# EAGLE design SAMD_Test_Board (EAGLE 9.6.2)

## Sheet 1 of 3: ARM SAMD21
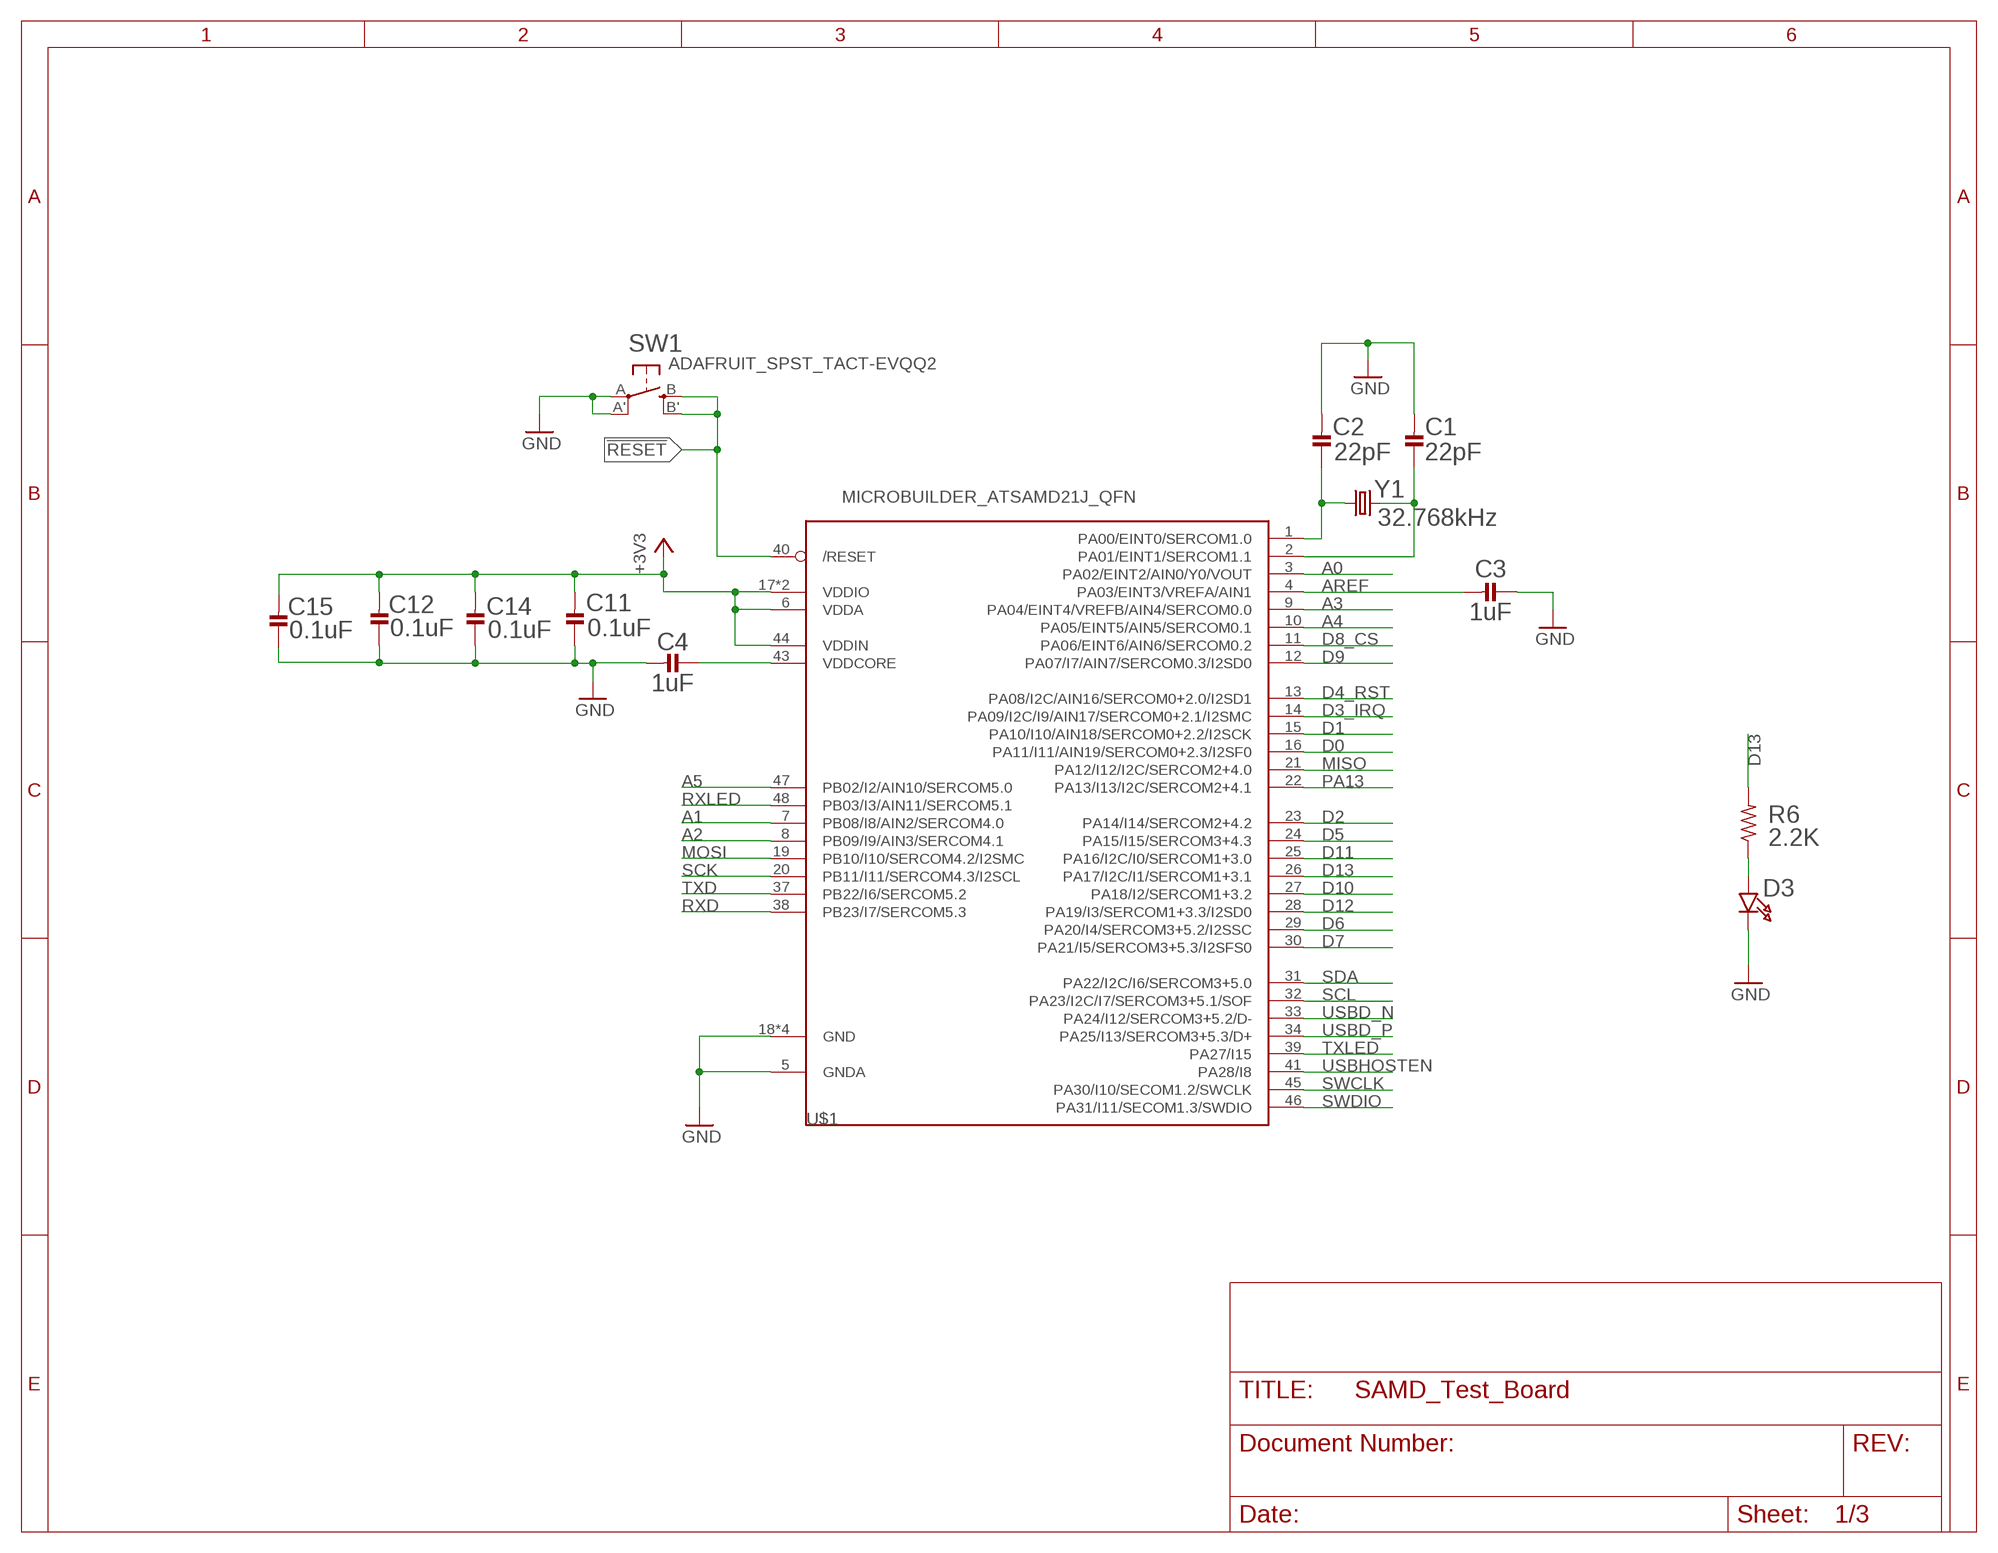
[diagram p0: schematic, sheet 1]

### Parts
C1  22pF  MICROBUILDER_CAP_CERAMIC_0805  [MICROBUILDER__0805]
C2  22pF  MICROBUILDER_CAP_CERAMIC_0805  [MICROBUILDER__0805]
C3  1uF  MICROBUILDER_CAP_CERAMIC_0805  [MICROBUILDER__0805]
C4  1uF  MICROBUILDER_CAP_CERAMIC_0805  [MICROBUILDER__0805]
C11  0.1uF  MICROBUILDER_CAP_CERAMIC_0805  [MICROBUILDER__0805]
C12  0.1uF  MICROBUILDER_CAP_CERAMIC_0805  [MICROBUILDER__0805]
C14  0.1uF  MICROBUILDER_CAP_CERAMIC_0805  [MICROBUILDER__0805]
C15  0.1uF  MICROBUILDER_CAP_CERAMIC_0805  [MICROBUILDER__0805]
D3  MICROBUILDER_LED0603  [MICROBUILDER_CHIPLED_0603]
R6  2.2K  R-US_R0805  [R0805]
SW1  ADAFRUIT_SPST_TACT-EVQQ2  [ADAFRUIT_EVQ-Q2]
U$1  MICROBUILDER_ATSAMD21J_QFN  [MICROBUILDER_TQFN48_7MM]
Y1  32.768kHz  CRYSTAL-32.768KHZSMD-3.2X1.5  [CRYSTAL-SMD-3.2X1.5MM]

### Nets
!RESET: SW1.B'(S1) SW1.B(S) U$1.40(/RESET)
+3V3 [Power]: C11.2 C12.2 C14.2 C15.2 U$1.6(VDDA) U$1.17(VDDIO) U$1.36(VDDIO) U$1.44(VDDIN) ; also sheet 2,3
A0: U$1.3(PA02/EINT2/AIN0/Y0/VOUT)
A1: U$1.7(PB08/I8/AIN2/SERCOM4.0)
A2: U$1.8(PB09/I9/AIN3/SERCOM4.1)
A3: U$1.9(PA04/EINT4/VREFB/AIN4/SERCOM0.0)
A4: U$1.10(PA05/EINT5/AIN5/SERCOM0.1)
A5: U$1.47(PB02/I2/AIN10/SERCOM5.0)
AREF: C3.2 U$1.4(PA03/EINT3/VREFA/AIN1)
D0: U$1.16(PA11/I11/AIN19/SERCOM0+2.3/I2SF0) ; also sheet 3
D1: U$1.15(PA10/I10/AIN18/SERCOM0+2.2/I2SCK) ; also sheet 3
D2: U$1.23(PA14/I14/SERCOM2+4.2)
D3_IRQ: U$1.14(PA09/I2C/I9/AIN17/SERCOM0+2.1/I2SMC) ; also sheet 2,3
D4_RST: U$1.13(PA08/I2C/AIN16/SERCOM0+2.0/I2SD1) ; also sheet 2,3
D5: U$1.24(PA15/I15/SERCOM3+4.3) ; also sheet 3
D6: U$1.29(PA20/I4/SERCOM3+5.2/I2SSC) ; also sheet 3
D7: U$1.30(PA21/I5/SERCOM3+5.3/I2SFS0)
D8_CS: U$1.11(PA06/EINT6/AIN6/SERCOM0.2) ; also sheet 2,3
D9: U$1.12(PA07/I7/AIN7/SERCOM0.3/I2SD0) ; also sheet 2,3
D10: U$1.27(PA18/I2/SERCOM1+3.2) ; also sheet 3
D11: U$1.25(PA16/I2C/I0/SERCOM1+3.0) ; also sheet 3
D12: U$1.28(PA19/I3/SERCOM1+3.3/I2SD0) ; also sheet 3
D13: R6.2 U$1.26(PA17/I2C/I1/SERCOM1+3.1) ; also sheet 3
GND [Power]: C1.2 C2.2 C3.1 C4.2 C11.1 C12.1 C14.1 C15.1 D3.C SW1.A'(P1) SW1.A(P) U$1.5(GNDA) U$1.18(GND) U$1.35(GND) U$1.42(GND) U$1.THERMAL(GND) ; also sheet 2,3
MISO: U$1.21(PA12/I12/I2C/SERCOM2+4.0) ; also sheet 2,3
MOSI: U$1.19(PB10/I10/SERCOM4.2/I2SMC) ; also sheet 2,3
N$1: C2.1 U$1.1(PA00/EINT0/SERCOM1.0) Y1.P$1
N$2: C1.1 U$1.2(PA01/EINT1/SERCOM1.1) Y1.P$2
N$4: C4.1 U$1.43(VDDCORE)
N$12: D3.A R6.1
PA13: U$1.22(PA13/I13/I2C/SERCOM2+4.1) ; also sheet 3
RXD: U$1.38(PB23/I7/SERCOM5.3) ; also sheet 3
RXLED: U$1.48(PB03/I3/AIN11/SERCOM5.1) ; also sheet 3
SCK: U$1.20(PB11/I11/SERCOM4.3/I2SCL) ; also sheet 2,3
SCL: U$1.32(PA23/I2C/I7/SERCOM3+5.1/SOF) ; also sheet 2,3
SDA: U$1.31(PA22/I2C/I6/SERCOM3+5.0) ; also sheet 2,3
SWCLK: U$1.45(PA30/I10/SECOM1.2/SWCLK) ; also sheet 3
SWDIO: U$1.46(PA31/I11/SECOM1.3/SWDIO) ; also sheet 3
TXD: U$1.37(PB22/I6/SERCOM5.2) ; also sheet 3
TXLED: U$1.39(PA27/I15) ; also sheet 3
USBD_N [USB_Diff_pair]: U$1.33(PA24/I12/SERCOM3+5.2/D-) ; also sheet 2
USBD_P [USB_Diff_pair]: U$1.34(PA25/I13/SERCOM3+5.3/D+) ; also sheet 2
USBHOSTEN: U$1.41(PA28/I8)

## Sheet 2 of 3: On-Board Modules
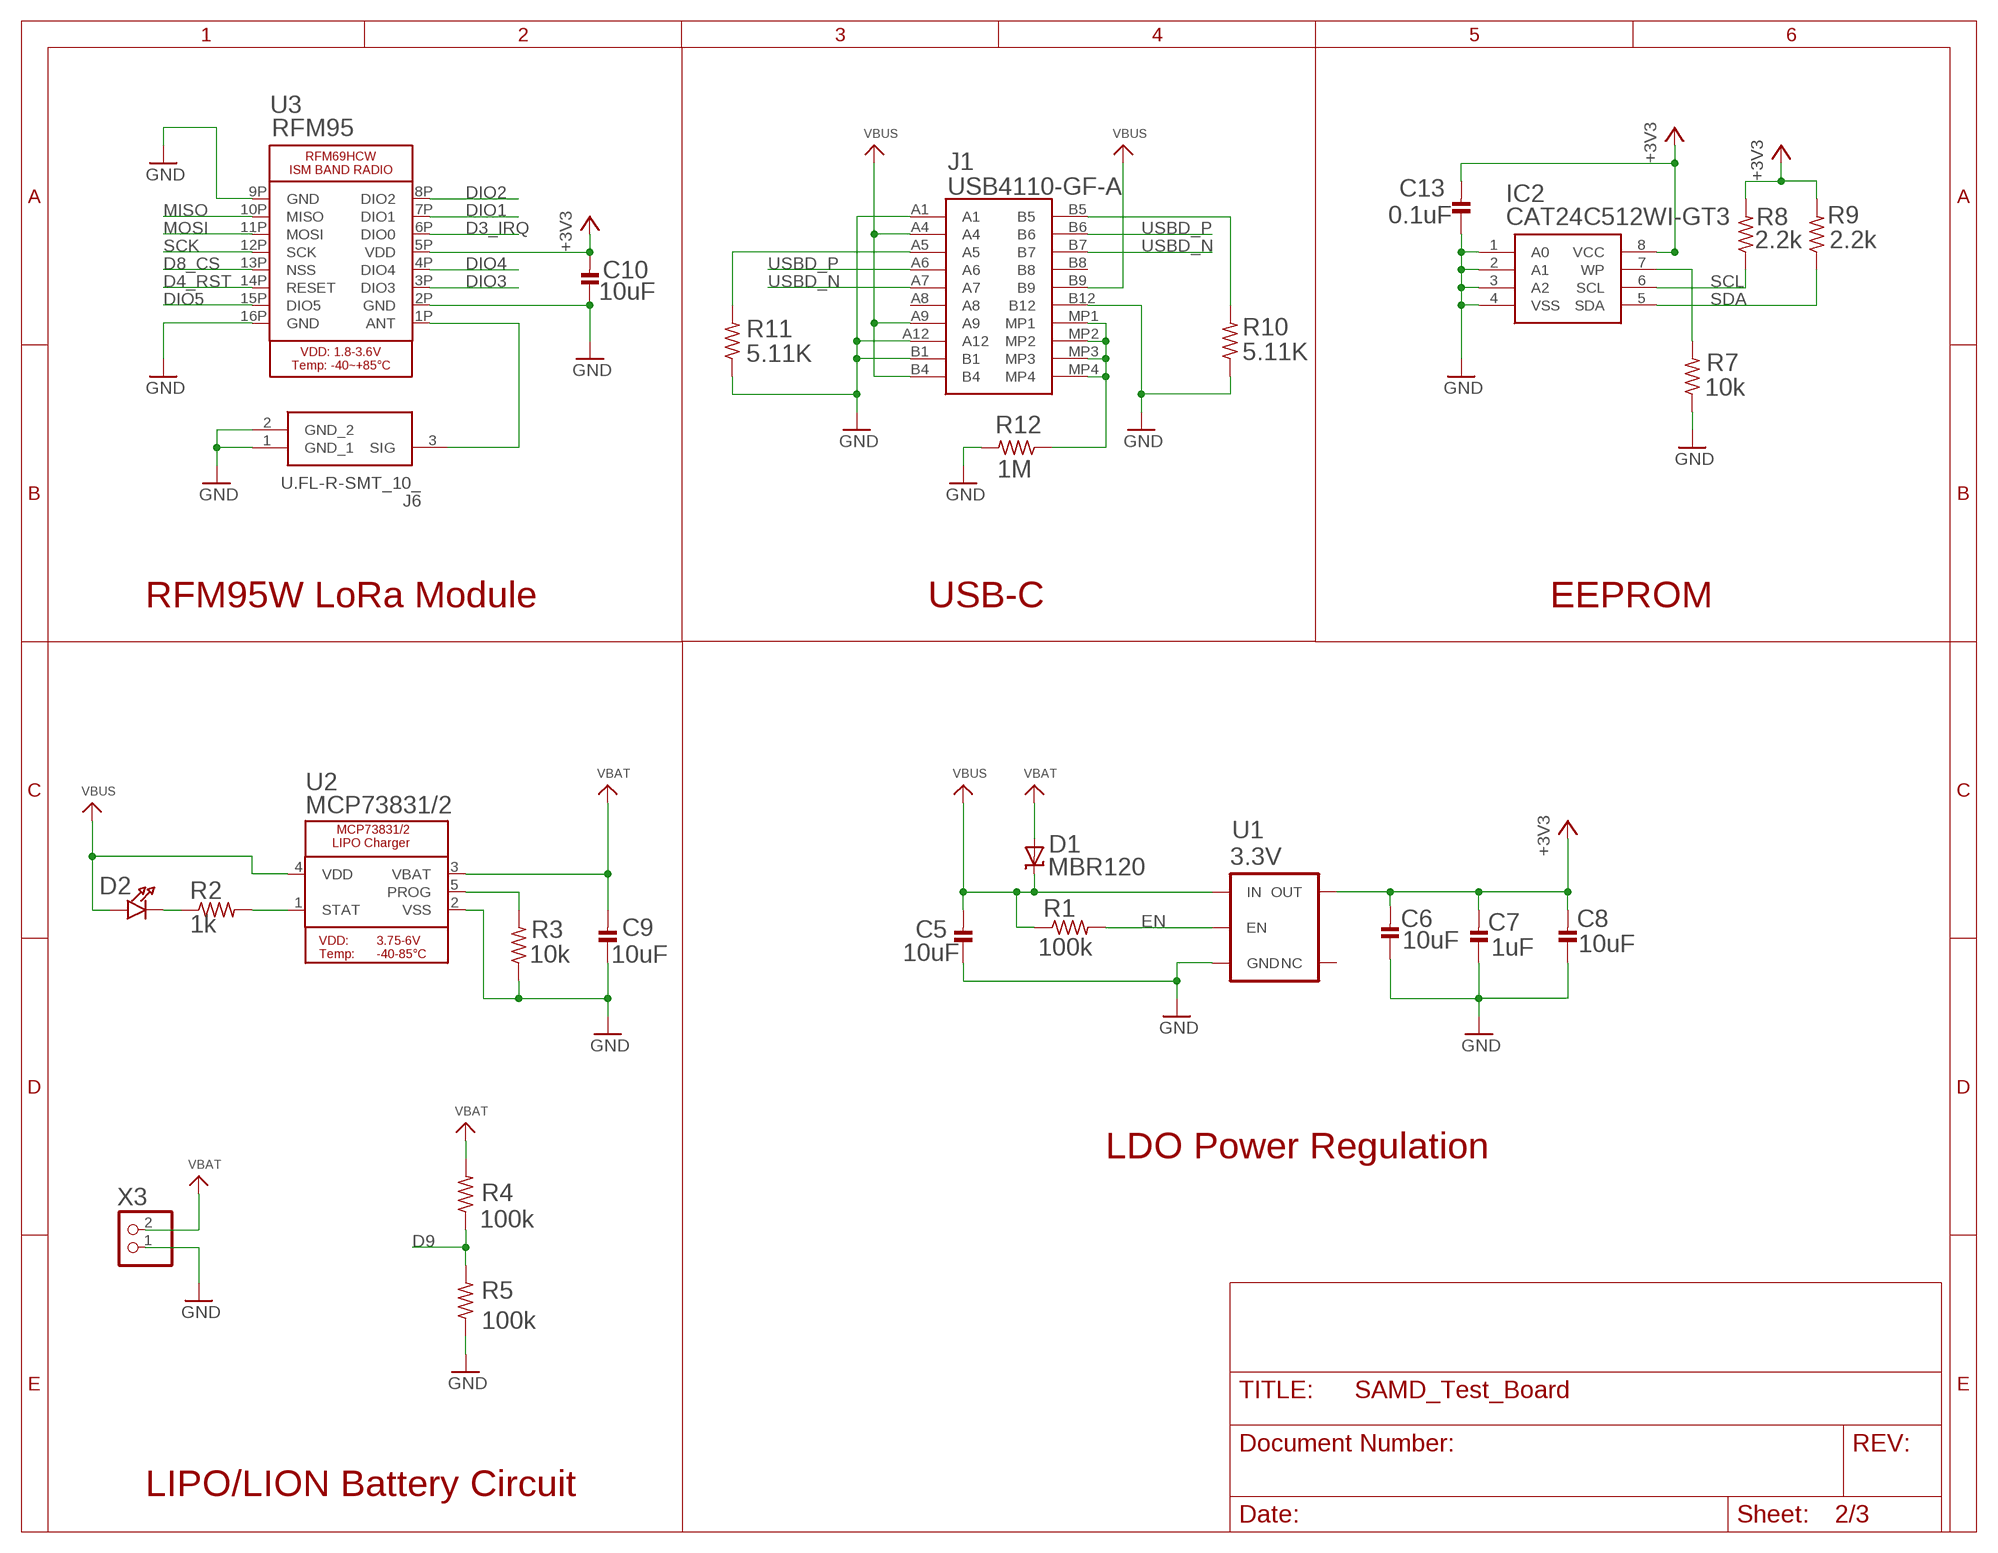
[diagram p1: schematic, sheet 2]

### Parts
C5  10uF  MICROBUILDER_CAP_CERAMIC_0805  [MICROBUILDER__0805]
C6  10uF  MICROBUILDER_CAP_CERAMIC_0805  [MICROBUILDER__0805]
C7  1uF  MICROBUILDER_CAP_CERAMIC_0805  [MICROBUILDER__0805]
C8  10uF  MICROBUILDER_CAP_CERAMIC_0805  [MICROBUILDER__0805]
C9  10uF  MICROBUILDER_CAP_CERAMIC_0805  [MICROBUILDER__0805]
C10  10uF  MICROBUILDER_CAP_CERAMIC_0805  [MICROBUILDER__0805]
C13  0.1uF  MICROBUILDER_CAP_CERAMIC_0805  [MICROBUILDER__0805]
D1  MBR120  MICROBUILDER_DIODE-SCHOTTKYSOD-123  [MICROBUILDER_SOD-123]
D2  MICROBUILDER_LED0603  [MICROBUILDER_CHIPLED_0603]
IC2  CAT24C512WI-GT3  [SOIC127P600X175-8N]
J1  USB4110-GF-A  [USB4110GFA]
J6  U.FL-R-SMT_10_  [UFLRSMT10]
R1  100k  R-US_R0805  [R0805]
R2  1k  R-US_R0805  [R0805]
R3  10k  R-US_R0805  [R0805]
R4  100k  R-US_R0805  [R0805]
R5  100k  R-US_R0805  [R0805]
R7  10k  R-US_R0805  [R0805]
R8  2.2k  R-US_R0805  [R0805]
R9  2.2k  R-US_R0805  [R0805]
R10  5.11K  R-US_R0805  [R0805]
R11  5.11K  R-US_R0805  [R0805]
R12  1M  R-US_R0805  [R0805]
U1  3.3V  V_REG_AP2112K-3.3V  [SOT23-5]
U2  MCP73831/2  MICROBUILDER_MCP73831/2  [MICROBUILDER_SOT23-5]
U3  RFM95  MICROBUILDER_RFM69HCW_SMT  [MICROBUILDER_RFMHCW_SMT]
X3  MICROBUILDER_CON_JST_PH_2PIN  [MICROBUILDER_JSTPH2]

### Nets
+3V3 [Power]: C6.2 C7.2 C8.2 C10.2 C13.2 IC2.8(VCC) R8.2 R9.2 U1.5(OUT) U3.5P(VDD) ; also sheet 1,3
D3_IRQ: U3.6P(DIO0) ; also sheet 1,3
D4_RST: U3.14P(RESET) ; also sheet 1,3
D8_CS: U3.13P(NSS) ; also sheet 1,3
D9: R4.1 R5.2 ; also sheet 1,3
DIO1: U3.7P(DIO1) ; also sheet 3
DIO2: U3.8P(DIO2) ; also sheet 3
DIO3: U3.3P(DIO3) ; also sheet 3
DIO4: U3.4P(DIO4) ; also sheet 3
DIO5: U3.15P(DIO5) ; also sheet 3
EN: R1.2 U1.3(EN) ; also sheet 3
GND [Power]: C5.1 C6.1 C7.1 C8.1 C9.1 C10.1 C13.1 IC2.1(A0) IC2.2(A1) IC2.3(A2) IC2.4(VSS) J1.A1 J1.A12 J1.B1 J1.B12 J6.1(GND_1) J6.2(GND_2) R3.1 R5.1 R7.1 R10.1 R11.1 R12.2 U1.2(GND) U2.2(VSS) U3.2P(GND) U3.9P(GND) U3.16P(GND) X3.1 ; also sheet 1,3
MISO: U3.10P(MISO) ; also sheet 1,3
MOSI: U3.11P(MOSI) ; also sheet 1,3
N$3: IC2.7(WP) R7.2
N$5: J1.A5 R11.2
N$6: D2.C R2.1
N$7: R2.2 U2.1(STAT)
N$8: R3.2 U2.5(PROG)
N$9: J1.B5 R10.2
N$10: J1.MP1 J1.MP2 J1.MP3 J1.MP4 R12.1
N$13: J6.3(SIG) U3.1P(ANT)
SCK: U3.12P(SCK) ; also sheet 1,3
SCL: IC2.6(SCL) R8.1 ; also sheet 1,3
SDA: IC2.5(SDA) R9.1 ; also sheet 1,3
USBD_N [USB_Diff_pair]: J1.A7 J1.B7 ; also sheet 1
USBD_P [USB_Diff_pair]: J1.A6 J1.B6 ; also sheet 1
VBAT [Power]: C9.2 D1.A R4.2 U2.3(VBAT) X3.2 ; also sheet 3
VBUS [Power]: C5.2 D1.C D2.A J1.A4 J1.A9 J1.B4 J1.B9 R1.1 U1.1(IN) U2.4(VDD) ; also sheet 3
Unconnected: J1.A8 J1.B8 U1.4(NC)

### Notes on the sheet
- RFM95W LoRa Module | USB-C | EEPROM
- LDO Power Regulation
- LIPO/LION Battery Circuit

## Sheet 3 of 3: Peripherals
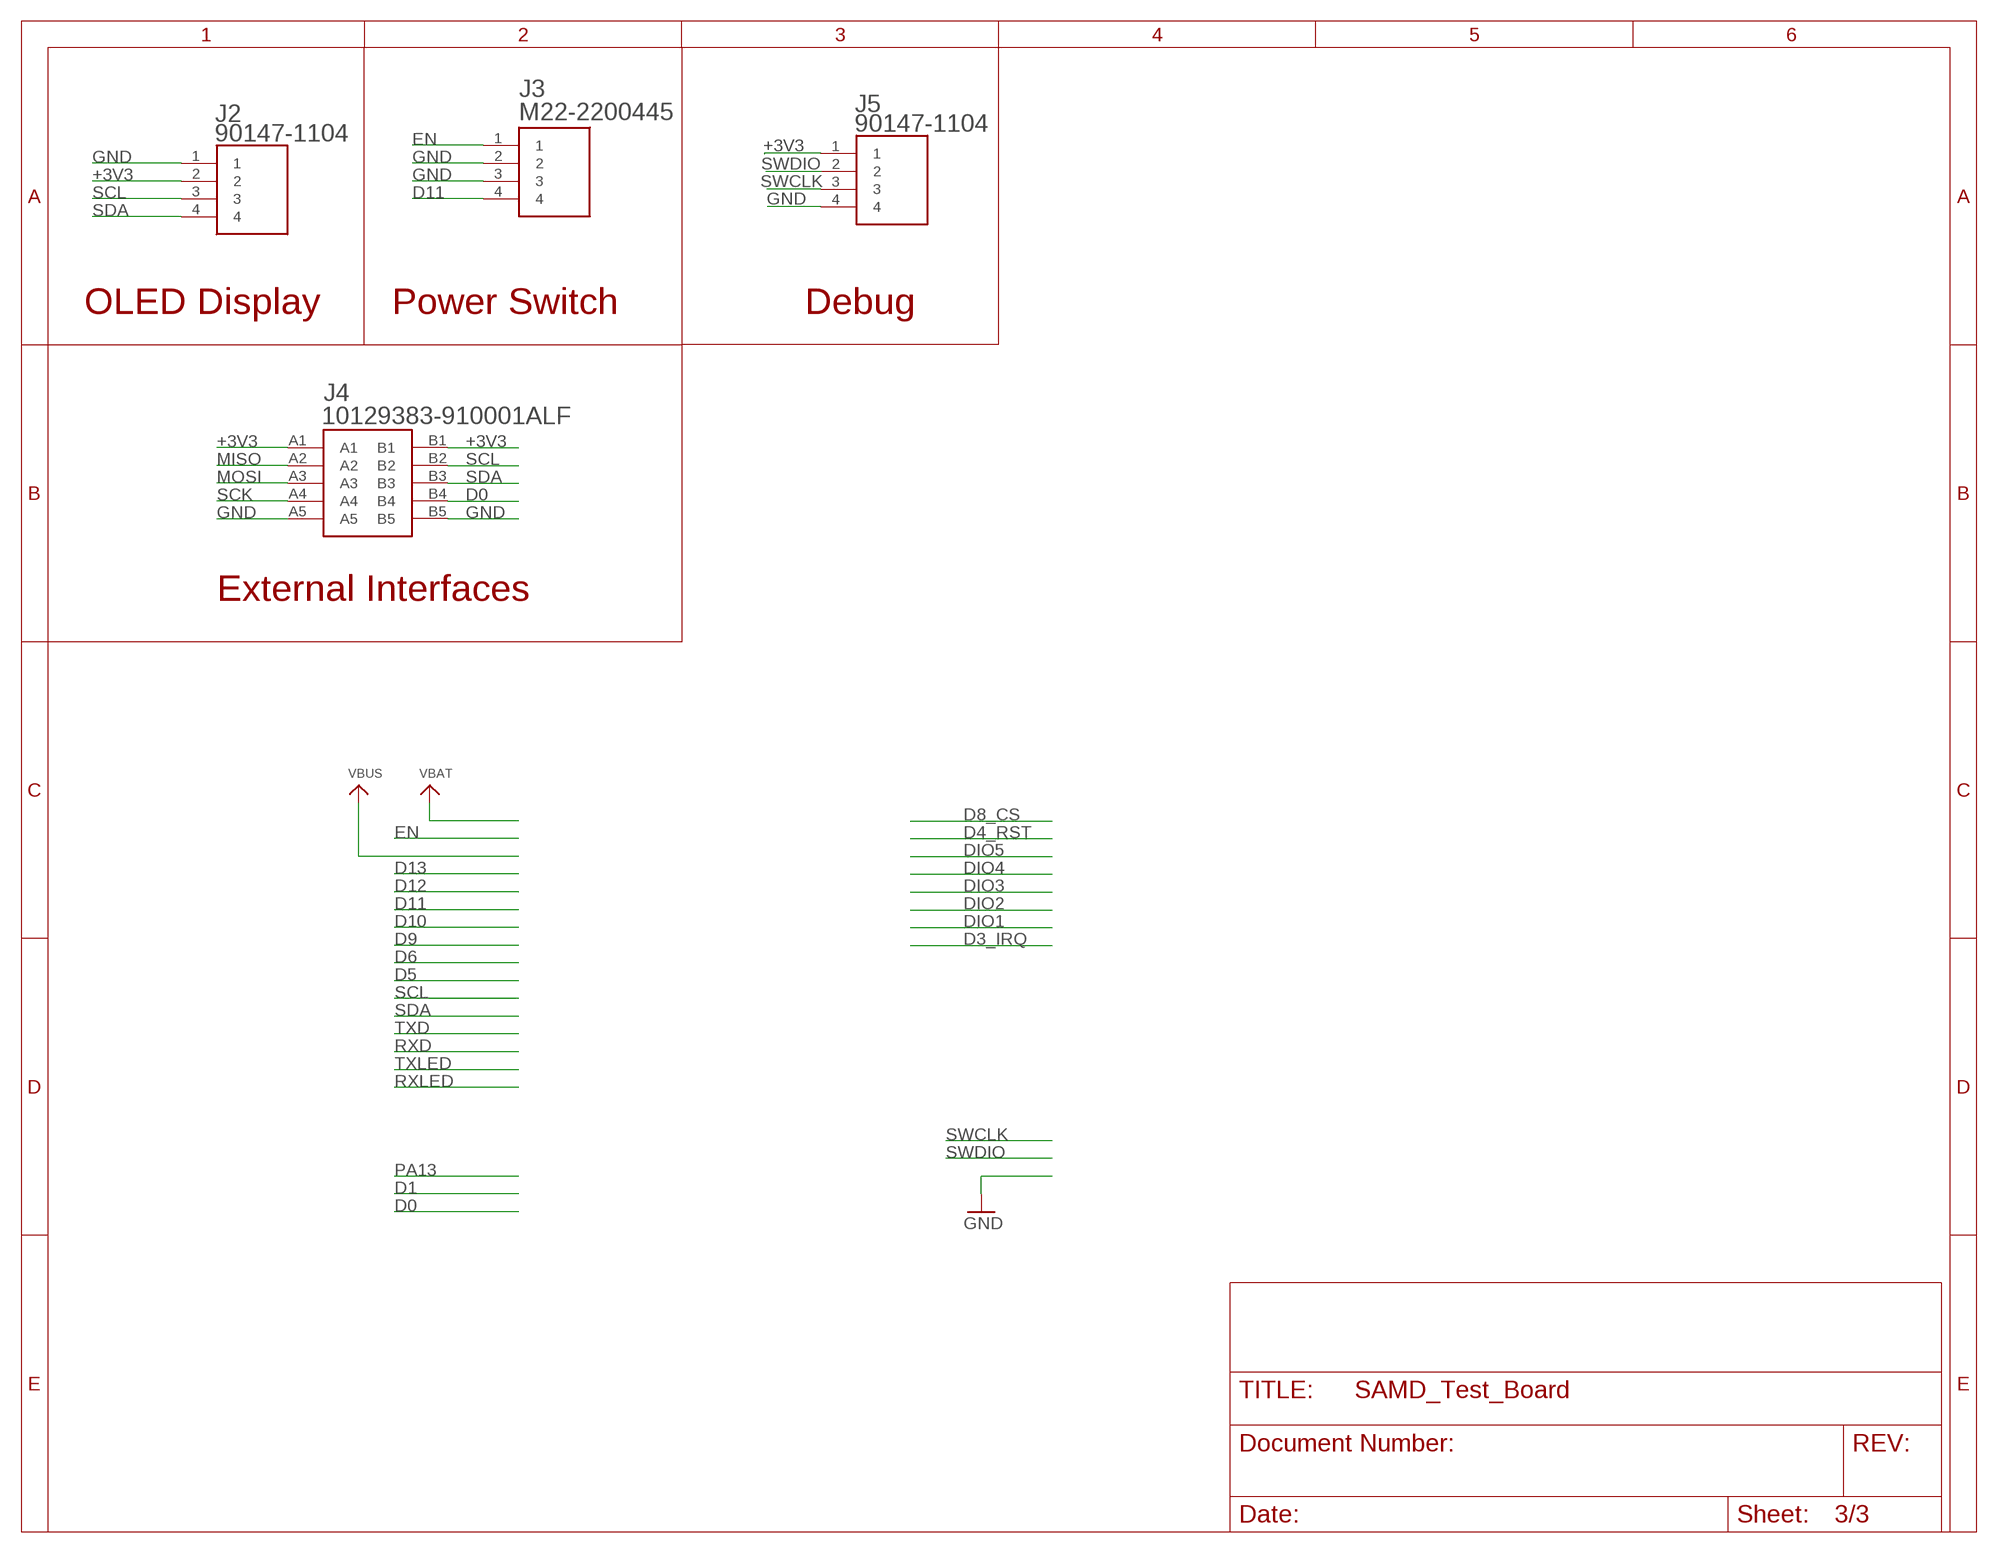
[diagram p2: schematic, sheet 3]

### Parts
J2  90147-1104  [RHDR4W70P0X254_1X4_1016X244X87]
J3  M22-2200445  [SHDR4W50P0X200_1X4_1000X470X63]
J4  10129383-910001ALF  [10129383910001ALF]
J5  90147-1104  [RHDR4W70P0X254_1X4_1016X244X87]

### Nets
+3V3 [Power]: J2.2 J4.A1 J4.B1 J5.1 ; also sheet 1,2
D0: J4.B4 ; also sheet 1
D11: J3.4 ; also sheet 1
EN: J3.1 ; also sheet 2
GND [Power]: J2.1 J3.2 J3.3 J4.A5 J4.B5 J5.4 ; also sheet 1,2
MISO: J4.A2 ; also sheet 1,2
MOSI: J4.A3 ; also sheet 1,2
SCK: J4.A4 ; also sheet 1,2
SCL: J2.3 J4.B2 ; also sheet 1,2
SDA: J2.4 J4.B3 ; also sheet 1,2
SWCLK: J5.3 ; also sheet 1
SWDIO: J5.2 ; also sheet 1

### Notes on the sheet
- OLED Display | Power Switch | Debug
- External Interfaces

## Library data of the parts
C1-C15 = Adafruit Feather M0 RFMxx:MICROBUILDER_CAP_CERAMIC: Ceramic Capacitors For new designs, use the packages preceded by an '_' character since they are more reliable: The following footprints should be used on most boards: _0402 - Standard footprint for regular board layouts _0603 - Standard footprint for regular board layouts _0805 - Standard footprint for regular board layouts _1206 - Standard footprint for regular board layouts For extremely tight-pitch boards where space is at a premium, the following 'micro-pitch' footprints can be used (smaller pads, no silkscreen outline, etc.): _0402MP - Micro-pitch footprint for very dense/compact boards _0603MP - Micro-pitch footprint for very dense/compact boards _0805MP - Micro-pitch footprint for very dense/compact boards _1206MP - Micro-pitch footprint for very dense/compact boards
D1 = Adafruit Feather M0 RFMxx:MICROBUILDER_DIODE-SCHOTTKY
D2 D3 = Adafruit Feather M0 RFMxx:MICROBUILDER_LED: LED 0603 - 0603 Surface Mount Package 2mA: Green LED - Low Power (3.9mcd, 2ma, 1.7Vf) - Digikey: 475-2709-2-ND Orange LED - Low Power (9.8mcd, 2ma, 1.8Vf) - Digikey: 475-1194-2-ND Red LED - Low Power (5mcd, 2ma, 1.8Vf) - Digikey: 475-1195-2-ND Yellow LED - Low Power (7mcd, 2ma, 1.8Vf) - Digikey: 475-1196-2-ND 5mA: Blue LED - Low Power (17mcd, 5ma, 2.9Vf) - Digikey: LNJ937W8CRACT-ND 0805 - 0805 Surface Mount Package 2mA: Red LED (8.8mcd, 2mA, 1.8Vf, Clear) - Low Power [Digikey: 475-2510-1-ND] Green LED (5mcd, 2mA, 1.8Vf, Clear) - Low Power [Digikey: 475-2730-1-ND] Yellow LED (11.3mcd, 2mA, 1.8Vf, Clear) - Low Power [Digikey: 475-2555-1-ND] 20mA: Red LED (104mcd, 20mA, Diffused) - LS R976 [Digikey: 475-1278-6-ND] Red LED (12mcd, 20mA, 2.0Vf, Clear) - APT2012EC [Digikey: 754-1128-1-ND] Green LED (15mcd, 20mA, 2.2Vf, Clear) - APT2012GC [Digikey: 754-1131-1-ND] Orange LED (160mcd, 20mA, 2.1Vf, Clear) - APT2012SECK [Digikey: 754-1130-1-ND] 1206 - 1206 Surface Mount Package Green LED (26mcd, 20mA, Diffused) - LG N971 [Digikey: 475-1407-6-ND] Red LED (15mcd, 20mA, Diffused) - LH N974 [Digikey: 475-1416-6-ND] Cree - Cree High-Power Surface Mount LEDs XPEBWT-L1-0000-00D50 - White 111lm 350mA 2.9Vf 6200K 110° XTEAWT-00-0000-00000LEE3 - White 114lm 350mA 2.85Vf 5000K 115° Everlight - Everlight 45-21 Series Surface Mount LEDs 45-21/QK2C-B2832AC2CB2/2T - Warm White 2000mcd 20mA 3.25Vf 3050K 120° 45-21/LK2C-B38452C4CB2/2T - Nuetral White 2000mcd 20mA 3.25Vf 4150K 120° 45-21/LK2C-B50634C6CB2/2T - Cold White 2200mcd 20mA 3.25Vf 5650K 120° PLCC2 Reverse Mount LS T77K-J1L2-1-0-2-R18-Z - Red 11.25mcd 2mA 1.8Vf 630nm 120° LO T77K-L1M2-24-Z - Orange 19.6mcd 2mA 1.8Vf 606nm 120° LY T77K-K2M1-26-Z - Yellow 15.7mcd 2mA 1.8Vf 587nm 120°
IC2 = SamacSys_Parts:CAT24C512WI-GT3: EEPROM,512kbit,64Kx8,1MHz I2C,SOIC8 ON Semiconductor CAT24C512WI-GT3 EEPROM Memory, 512kb, 400ns, 1.8 5.5 V 8-Pin SOIC Source: Datasheet <http://www.onsemi.com/pub/Collateral/CAT24C512-D.PDF>; DESCRIPTION: EEPROM,512kbit,64Kx8,1MHz I2C,SOIC8 ON Semiconductor CAT24C512WI-GT3 EEPROM Memory, 512kb, 400ns, 1.8 5.5 V 8-Pin SOIC; HEIGHT: 1.75mm; MANUFACTURER_NAME: ON Semiconductor; MANUFACTURER_PART_NUMBER: CAT24C512WI-GT3; MOUSER_PART_NUMBER: 863-CAT24C512WI-GT3; MOUSER_PRICE-STOCK: https://www.mouser.co.uk/ProductDetail/ON-Semiconductor/CAT24C512WI-GT3?qs=NJQfjRgVp6ROyXrGKjEjgQ%3D%3D
J1 = SamacSys_Parts:USB4110-GF-A: CONN USB 2.0 TYPE-C R/A SMT Source: Datasheet <https://gct.co/files/drawings/usb4110.pdf>; DESCRIPTION: CONN USB 2.0 TYPE-C R/A SMT; HEIGHT: 3.26mm; MANUFACTURER_NAME: GCT (GLOBAL CONNECTOR TECHNOLOGY); MANUFACTURER_PART_NUMBER: USB4110-GF-A; MOUSER_PART_NUMBER: 640-USB4110-GF-A; MOUSER_PRICE-STOCK: https://www.mouser.co.uk/ProductDetail/GCT/USB4110-GF-A?qs=KUoIvG%2F9IlYiZvIXQjyJeA%3D%3D
J2 J5 = SamacSys_Parts:90147-1104: Headers & Wire Housings 2.54MM 4P PCB CONN SR VERTICAL Source: Datasheet; DESCRIPTION: Headers & Wire Housings 2.54MM 4P PCB CONN SR VERTICAL; HEIGHT: 8.7mm; MANUFACTURER_NAME: Molex; MANUFACTURER_PART_NUMBER: 90147-1104; MOUSER_PART_NUMBER: 538-90147-1104; MOUSER_PRICE-STOCK: https://www.mouser.co.uk/ProductDetail/Molex/90147-1104?qs=QESXi79X%252BKpRACDRmfEx7Q%3D%3D
J3 = SamacSys_Parts:M22-2200445: 4 SIL VERT SHROUDED PIN HDR ROHS COMPLIANT: YES Source: Datasheet; DESCRIPTION: 4 SIL VERT SHROUDED PIN HDR ROHS COMPLIANT: YES; HEIGHT: 6.35mm; MANUFACTURER_NAME: Harwin; MANUFACTURER_PART_NUMBER: M22-2200445; MOUSER_PART_NUMBER: 855-M22-2200445; MOUSER_PRICE-STOCK: https://www.mouser.co.uk/ProductDetail/Harwin/M22-2200445/?qs=p%252BybrH12zCH0J5aaSlth2Q%3D%3D
J4 = SamacSys_Parts:10129383-910001ALF: EconoStik, Board to Board connector, Unshrouded Vertical Header, Surface Mount, Double Row, Positions, 2.54 mm (0.100in) Pitch. Source: Datasheet <https://cdn.amphenol-icc.com/media/wysiwyg/files/drawing/10129383.pdf>; DESCRIPTION: EconoStik, Board to Board connector, Unshrouded Vertical Header, Surface Mount, Double Row, Positions, 2.54 mm (0.100in) Pitch.; HEIGHT: 9.85mm; MANUFACTURER_NAME: Amphenol; MANUFACTURER_PART_NUMBER: 10129383-910001ALF; MOUSER_PART_NUMBER: 649-1012938391001ALF; MOUSER_PRICE-STOCK: https://www.mouser.co.uk/ProductDetail/Amphenol-FCI/10129383-910001ALF?qs=0lQeLiL1qyY3dF%252BDHWxqLA%3D%3D
J6 = SamacSys_Parts:U.FL-R-SMT_10_: RF Connectors / Coaxial Connectors U.FL RECEPTACLE SMT GLD M CONT REEL Source: Datasheet <https://media.digikey.com/pdf/Data Sheets/Hirose PDFs/UFL Series.pdf>; DESCRIPTION: RF Connectors / Coaxial Connectors U.FL RECEPTACLE SMT GLD M CONT REEL; HEIGHT: 1.25mm; MANUFACTURER_NAME: Hirose; MANUFACTURER_PART_NUMBER: U.FL-R-SMT(10); MOUSER_PART_NUMBER: 798-U.FL-R-SMT10; MOUSER_PRICE-STOCK: https://www.mouser.co.uk/ProductDetail/Hirose-Connector/UFL-R-SMT10?qs=Ux3WWAnHpjBT1CWD8UMEMQ%3D%3D
R1-R7 R9-R12 = Adafruit Feather M0 RFMxx:R-US_: RESISTOR, American symbol
R8 = Adafruit Feather M0 RFMxx:R-US_: RESISTOR, American symbol; MOUSER: CR0805-JW-202ELF
SW1 = Adafruit Feather M0 RFMxx:ADAFRUIT_SPST_TACT: SMT 6mm switch, EVQQ2 series http://www.ladyada.net/library/eagle
U1 = SamacSys_Parts:V_REG_AP2112: AP2112 - 600mA CMOS LDO Regulator w/ Enable The AP2112 is CMOS process low dropout linear regulator with enable function, the regulator delivers a guaranteed 600mA (min.) continuous load current. Features Output Voltage Accuracy: ±1.5% Output Current: 600mA (Min.) Foldback Short Current Protection: 50mA Enable Function to Turn ON/OFF VOUT Low Dropout Voltage (3.3V): 250mV (Typ.) @IOUT=600mA Excellent Load Regulation: 0.2%/A (Typ.) Excellent Line Regulation: 0.02%/V (Typ.) Low Quiescent Current: 55μA (Typ.) Low Standby Current: 0.01μA (Typ.) Low Output Noise: 50μVRMS PSRR: 100Hz -65dB, 1kHz -65dB OTSD Protection Stable with 1.0μF Flexible Cap: Ceramic, Tantalum and Aluminum Electrolytic Operation Temperature Range: -40°C to 85°C ESD: MM 400V, HBM 4000V; PROD_ID: VREG-12457
U2 = Adafruit Feather M0 RFMxx:MICROBUILDER_MCP73831/2: MCP73831/2 LIPO Charger VDD: 3.75 - 6V Temp -40 - 85°C Programmable Charge Rate: 15-500mA NOTE: STAT is a tri-state logic output on the MCP73831 and an open-drain output on the MCP73832. SOT23-5 with 4.2V output and tri-state logic on STAT = MCP73831T-2ACI/OT
U3 = Adafruit Feather M0 RFMxx:MICROBUILDER_RFM69HCW: RFM69HCW - ISM Band RF Transceiver
U$1 = Adafruit Feather M0 RFMxx:MICROBUILDER_ATSAMD21J
X3 = Adafruit Feather M0 RFMxx:MICROBUILDER_CON_JST_PH_2PIN: JST 2-Pin Right-Angle Connector PH-Series - 4UConnector: 17311 SH-Series - 4UConnector: 07278
Y1 = SparkFun-Clocks:CRYSTAL-32.768KHZ: 32.768kHz Crystal Frequency: 32.768kHz Frequency Stability: ±20ppm Load Capacitance: 12.5pF (PTH-2X6 & SMD-3.2X1.5), 6pF (SMD-2X6) SparkFun Products: SparkFun BigTime Watch Kit <https://www.sparkfun.com/products/11734> SparkFun nRF52832 Breakout <https://www.sparkfun.com/products/13990> SparkFun Real Time Clock Module <https://www.sparkfun.com/products/12708>; PROD_ID: XTAL-13062

## Net classes
0 default: width 0.152 mm
1 USB_Diff_pair: width 0.152 mm
2 Power: width 0.254 mm

## Board
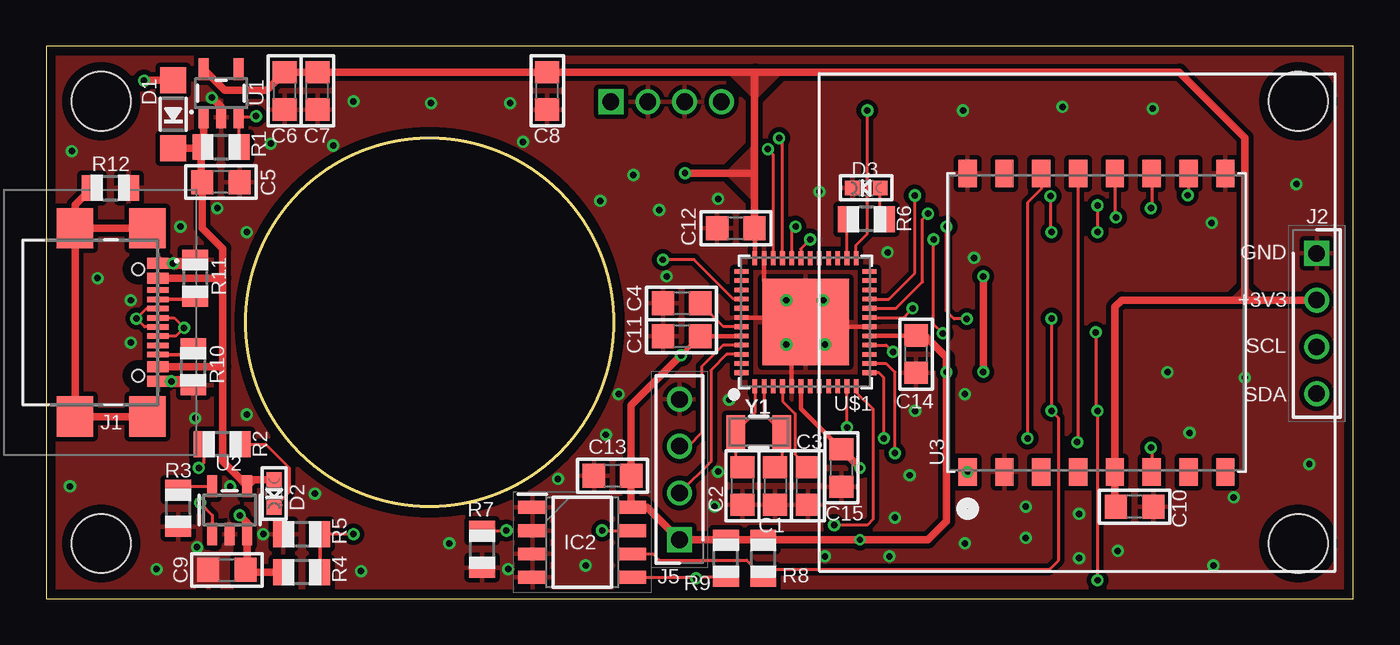
[diagram p3: board, top side]
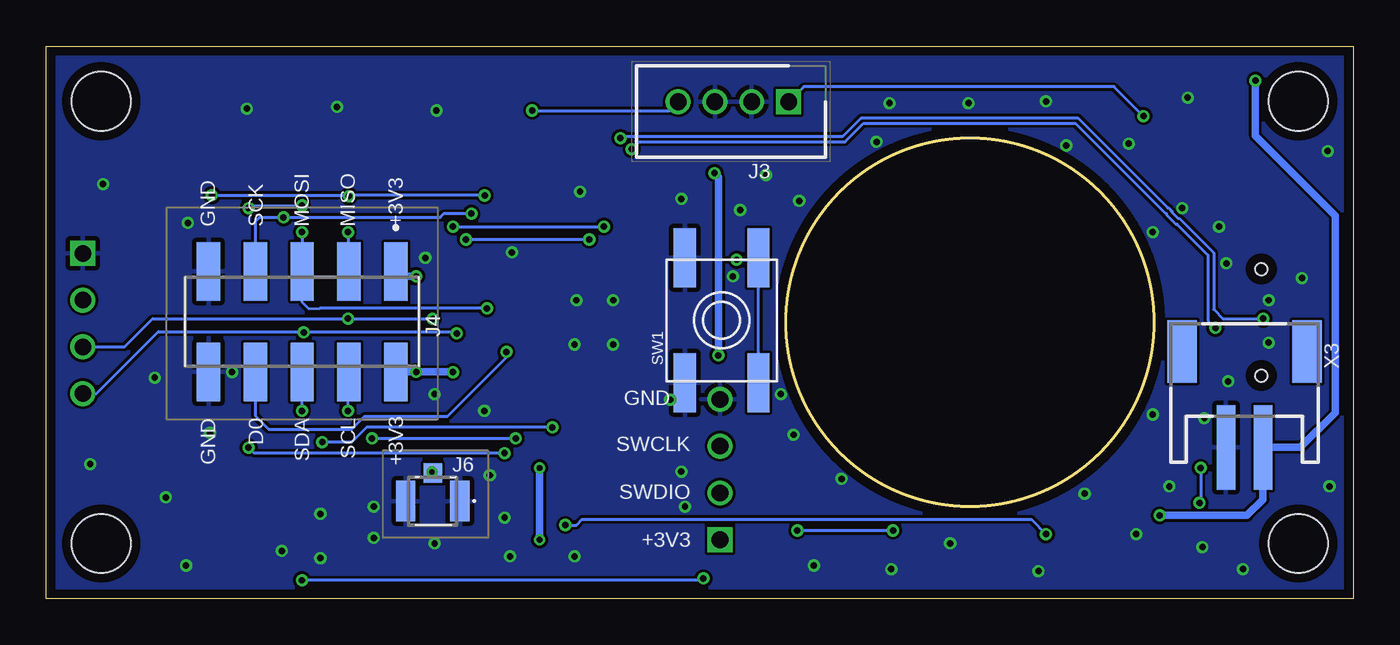
[diagram p4: board, bottom side, seen from below]

Size 71 x 30 mm. Coordinates in mm from the lower left corner, seen from the top.
Outline: 0,0 71,0 71,30 0,30 0,0
Outline: circle at 20.83,15 radius 10
Copper layers (1*16): Top 0.035mm / dielectric 1.6mm / Bottom 0.035mm
Design rules "Elecrow_2-layer_PCB_eagle_rule": minimum track width 6mil, minimum drill 12mil, track to track 6mil, track to pad 6mil, pad to pad 6mil, via to via 8mil, smd to smd 0mil, copper to edge 20mil, drill to drill 10mil, minimum pad ring 6mil, minimum via ring 6mil, stop-mask expansion 0mil, vias tented up to drill 100mil, thermal gap 10mil
Holes 3.2 mm at 3,3 3,27 68,27 68,3
tKeepout: area 0,24 to 6,30; area 0,0 to 6,6; area 65,24 to 71,30; area 65,0 to 71,6

### Footprints (pad centres in the part's own frame; a part is rotated, then mirrored left to right if it is on the bottom)
MICROBUILDER__0805 = smd 1.2 x 1.3: 1 -1.016,0; 2 1.016,0
MICROBUILDER_SOD-123 = smd 1.4 x 1.4: A 1.85,0; C -1.85,0
MICROBUILDER_CHIPLED_0603 = smd 0.8 x 0.8: A 0,-0.75; C 0,0.75
SOIC127P600X175-8N = smd 1.525 x 0.7: 1 -2.712,1.905; 2 -2.712,0.635; 3 -2.712,-0.635; 4 -2.712,-1.905; 5 2.712,-1.905; 6 2.712,-0.635; 7 2.712,0.635; 8 2.712,1.905
USB4110GFA = smd 0.3 x 1.15: A1 -3.35,3.678; A4 -2.55,3.678; A5 -1.25,3.678; A6 -0.25,3.678; A7 0.25,3.678; A8 1.25,3.678; A9 2.55,3.678; A12 3.35,3.678; B1 3.05,3.678; B4 2.25,3.678; B5 1.75,3.678; B6 0.75,3.678; B7 -0.75,3.678; B8 -1.75,3.678; B9 -2.25,3.678; B12 -3.05,3.678 | smd 2.18 x 2: MP1 -5.11,-0.827; MP2 5.11,-0.827; MP3 -5.11,3.103; MP4 5.11,3.103 | hole 0.65: -2.89,2.603; 2.89,2.603
RHDR4W70P0X254_1X4_1016X244X87 = drill 0.9 pad 1.35 square: 1 0,0 | drill 0.9 pad 1.35: 2 2.54,0; 3 5.08,0; 4 7.62,0
SHDR4W50P0X200_1X4_1000X470X63 = drill 0.9 pad 1.35 square: 1 0,0 | drill 0.9 pad 1.35: 2 2,0; 3 4,0; 4 6,0
10129383910001ALF = smd 1.27 x 3.18: A1 -5.08,-2.73; A2 -2.54,-2.73; A3 0,-2.73; A4 2.54,-2.73; A5 5.08,-2.73; B1 -5.08,2.73; B2 -2.54,2.73; B3 0,2.73; B4 2.54,2.73; B5 5.08,2.73
UFLRSMT10 = smd 1.05 x 2.2: 1 -1.475,0; 2 1.475,0 | smd 1 x 1.05: 3 0,-1.525
R0805 = smd 1.1 x 1.4: 1 -1,0; 2 1,0
ADAFRUIT_EVQ-Q2 = smd 3.2 x 1.2: A -3.4,-2; A' 3.4,-2; B -3.4,2; B' 3.4,2
SOT23-5 = smd 0.55 x 1.2: 1 -0.95,-1.3; 2 0,-1.3; 3 0.95,-1.3; 4 0.95,1.3; 5 -0.95,1.3
MICROBUILDER_SOT23-5 = smd 0.55 x 1.2: 1 -0.95,-1.3; 2 0,-1.3; 3 0.95,-1.3; 4 0.95,1.3; 5 -0.95,1.3
MICROBUILDER_RFMHCW_SMT = smd 1.5 x 1: 1P 8.1,-7; 2P 8.1,-5; 3P 8.1,-3; 4P 8.1,-1; 5P 8.1,1; 6P 8.1,3; 7P 8.1,5; 8P 8.1,7; 9P -8.1,7; 10P -8.1,5; 11P -8.1,3; 12P -8.1,1; 13P -8.1,-1; 14P -8.1,-3; 15P -8.1,-5; 16P -8.1,-7
MICROBUILDER_TQFN48_7MM = smd 0.25 x 0.75: 1 -2.75,-3.475; 2 -2.25,-3.475; 3 -1.75,-3.475; 4 -1.25,-3.475; 5 -0.75,-3.475; 6 -0.25,-3.475; 7 0.25,-3.475; 8 0.75,-3.475; 9 1.25,-3.475; 10 1.75,-3.475; 11 2.25,-3.475; 12 2.75,-3.475; 25 2.75,3.475; 26 2.25,3.475; 27 1.75,3.475; 28 1.25,3.475; 29 0.75,3.475; 30 0.25,3.475; 31 -0.25,3.475; 32 -0.75,3.475; 33 -1.25,3.475; 34 -1.75,3.475; 35 -2.25,3.475; 36 -2.75,3.475 | smd 0.75 x 0.25: 13 3.475,-2.75; 14 3.475,-2.25; 15 3.475,-1.75; 16 3.475,-1.25; 17 3.475,-0.75; 18 3.475,-0.25; 19 3.475,0.25; 20 3.475,0.75; 21 3.475,1.25; 22 3.475,1.75; 23 3.475,2.25; 24 3.475,2.75; 37 -3.475,2.75; 38 -3.475,2.25; 39 -3.475,1.75; 40 -3.475,1.25; 41 -3.475,0.75; 42 -3.475,0.25; 43 -3.475,-0.25; 44 -3.475,-0.75; 45 -3.475,-1.25; 46 -3.475,-1.75; 47 -3.475,-2.25; 48 -3.475,-2.75 | smd 4.7 x 4.7: THERMAL 0,0
MICROBUILDER_JSTPH2 = smd 1 x 4.6: 1 -1,-3.7; 2 1,-3.7 | smd 1.6 x 3.4: NC1 -3.4,1.5; NC2 3.4,1.5
CRYSTAL-SMD-3.2X1.5MM = smd 1 x 1.8: P$1 -1.25,0; P$2 1.25,0

### Placement (x,y rotation side)
C1  39.59,6.12 270 top
C2  37.81,6.12 270 top
C3  41.37,6.12 90 top
C4  34.51,16.03 180 top
C5  9.5,22.61 180 top
C6  12.96,27.57 90 top
C7  14.74,27.57 90 top
C8  27.22,27.57 90 top
C9  9.82,1.56 0 top
C10  59.12,4.99 180 top
C11  34.51,14.25 0 top
C12  37.46,20.11 0 top
C13  30.76,6.68 0 top
C14  47.25,13.27 90 top
C15  43.2,7.1 90 top
D1  6.91,26.3 90 top
D2  12.39,5.71 180 top
D3  44.55,22.3 90 top
IC2  29.12,3.06 0 top
J1  2.4,15 270 top
J2  69,18.75 270 top
J3  30.68,26.98 180 bottom
J4  57.09,15.04 180 bottom
J5  34.4,3.2 90 top
J6  50,5.3 180 bottom
R1  9.5,24.52 0 top
R2  9.56,8.38 180 top
R3  7.18,4.91 90 top
R4  13.88,1.44 180 top
R5  13.88,3.5 0 top
R6  44.55,20.6 180 top
R7  23.68,2.69 90 top
R8  38.95,2.2 90 top
R9  36.92,2.2 90 top
R10  8,12.6 90 top
R11  8.1,17.4 270 top
R12  3.5,22.3 0 top
SW1  34.31,15.11 270 bottom
U1  9.5,27.44 0 top
U2  9.97,4.81 0 top
U3  57.04,14.98 270 top
U$1  41.24,15.01 0 top
X3  5.92,11.91 0 bottom
Y1  38.7,9.04 0 top

### Tracks (layer width: path | path; a pad name or v marks a point on that pad's centre or on a via)
!RESET  (via drill 0.35)
  Top 0.152: U$1.40 37.34,16.26 35.2,18.4 v33.5,18.4
  Bottom 0.152: v33.5,18.4 32.42,18.4 | 32.42,18.4 32.51,18.31 32.31,18.11 SW1.B' | 32.42,18.4 SW1.B
+3V3  (via drill 0.3, 0.35)
  Top 0.254: U$1.17 47.23,14.26 C14.2 | U$1.44 37.76,14.25 C11.2 v34.49,13.21 | C15.2 40.99,10.32 U$1.6 | U$1.36 38.49,20.1 C12.2 | 38.48,28.57 38.5,28.59
  Top 0.406: U1.5 9.69,27.6 11.97,27.6 C6.2 C7.2 C8.2 38.5,28.59 61.54,28.59 65.1,25.03 65.1,16.2 65.11,16.21 | 47.23,14.26 47.74,14.26 48.9,13.1 v48.9,12.3 48.9,4.2 47.9,3.2 v44.2,3.2 R8.2 R9.2 J5.1 32.63,4.97 IC2.8 31.78,5.02 C13.2 31.78,10.5 v34.49,13.21 | C12.2 38.48,23.1 | 38.48,23.1 38.48,28.57 | J2.2 65.11,16.21 | 38.48,23.1 v34.7,23.1 | 65.11,16.21 58.41,16.21 58.04,15.84 U3.5P 58.04,5.05 C10.2 | v50.9,17.5 v50.9,12.31 | C15.2 44.2,7.12 v44.2,7.1
  Bottom 0.406: v34.7,23.1 34.49,22.89 v34.49,13.21 | J4.B1 v50.9,12.31 48.91,12.31 v48.9,12.3 | J4.A1 51.74,17.5 v50.9,17.5 | v44.2,7.1 v44.2,3.2
  pour Top: 65.1,17 64.3,16.2 65.8,16.2 65.9,16.2
  pour Top: 38.5,27.2 39.9,28.6 37.3,28.6 37.1,28.6
  pour Top (no thermals): 38.5,21.6 37,23.1 38.5,24.6
AREF
  Top 0.152: U$1.4 39.99,10.73 40.68,10.04 40.68,7.83 C3.2
D0  (via drill 0.35)
  Top 0.152: U$1.16 45.64,13.76 v46,13.4
  Bottom 0.152: J4.B4 59.63,9.93 58.9,9.2 54.4,9.2 53.7,9.9 49.2,9.9 46,13.1 v46,13.4
D3_IRQ  (via drill 0.35)
  Top 0.152: v46.1,7.9 46.1,12.3 45.64,12.76 U$1.14 | v60,8.2 60.04,8.16 U3.6P
  Bottom 0.152: v46.1,7.9 59.7,7.9 v60,8.2
D4_RST  (via drill 0.35)
  Top 0.152: v45.5,8.7 45.5,12 45.24,12.26 U$1.13 | U3.14P 54.04,22.24 53.3,21.5 v53.3,8.7
  Bottom 0.152: v53.3,8.7 v45.5,8.7
D8_CS  (via drill 0.35)
  Top 0.152: v43.5,9.3 U$1.11 | U3.13P 56.04,8.54 v56,8.5
  Bottom 0.152: v43.5,9.3 53.6,9.3 54.4,8.5 v56,8.5
D9  (via drill 0.35)
  Top 0.152: U$1.12 43.99,11.21 44.9,10.3 44.9,4.3 44.6,4 v42.8,4 | v16.7,3.5 R5.2
  Top 0.203: R4.1 R5.2
  Bottom 0.152: v42.8,4 42.2,4 41.9,4.3 17.5,4.3 v16.7,3.5
D11  (via drill 0.35)
  Top 0.152: U$1.25 43.99,19.19 44.6,19.8 v44.6,26.5
  Bottom 0.152: v44.6,26.5 37.15,26.5 J3.4
D13
  Top 0.152: U$1.26 43.49,20.55 R6.2
EN  (via drill 0.35)
  Top 0.152: v11.4,26.2 11.34,26.14 U1.3 10.45,24.57 R1.2
  Bottom 0.152: v11.4,26.2 13,27.8 29.85,27.8 J3.1
GND  (via drill 0.35)
  Top 0.254: U$1.42 40.99,15.26 U$1.THERMAL | U$1.18 41.49,14.76 U$1.THERMAL | U$1.35 38.99,17.26 U$1.THERMAL | U$1.5 40.49,13.51 v40.2,13.8 40.2,13.97 U$1.THERMAL
  Top 0.305: J1.B12 7.75,18.05 | J1.A1 7.95,18.35 8,18.3 | J1.A12 7.95,11.65 | 7.95,11.65 R10.1 | J1.B1 7.65,11.95 7.95,11.65
  Top 0.406: U1.2 9.5,26.7 v9,27.2 | 6.13,18.4 J1.A1 | 7.75,18.05 8,18.3 R11.1
  other vias: 10,6.1 8.1,9.8 4.6,13.9 7.3,20.2 4.6,16.2 25.1,1.6 9.3,21.2 1.4,24.3 12.2,24.7 8.2,2.8 1.3,6.1 11.8,3.5 40.2,16.2 42.2,16.2 42.3,13.8 33.7,17.5 25.9,24.8 15.6,24.6 30.1,21.6 31.1,11.1 36.5,21.7 45.7,18.8 42.3,2.3 63.3,20.4 50.4,18.5 67.9,22.5 60.1,26.6 49.8,26.5 65.1,12 68.6,7.3 64.5,5.5 63.4,1.8 53.2,3.3 45.8,2.3 49.9,11.1 14.6,5.7 10.9,10 30.4,8.9 27.8,6.5 21.9,3 17.1,1.5 29.3,1.8 6,1.6 2.8,17.4 6.8,11.8 6.9,18.2 36.3,5 36.5,6.9 37.1,10.8 33.3,21.1 42,22.1 16.7,27 20.9,26.9 10.9,19.9 47.2,10.2 46.9,6.7 56.1,4.6 56.1,2.2 53.2,5 49.9,3 62.1,9 46.1,4.4 58.2,2.6 60.9,12.3 55.2,26.7 25.2,26.9 31.9,23
  pour Top (isolate 0.254, rank 6): 0,30 0,0 71,0 71,30
  pour Bottom (rank 6): 0,30 0,0 71,0 71,30
  pour Top (no thermals): 9.8,3.1 9.6,2.9 9.6,2.7 9.4,2.5 7.9,2.5 7.9,0.7 9.9,0.7 9.9,2.3 10.1,2.5 10.1,3.1
MISO  (via drill 0.35)
  Top 0.152: U3.10P 62.04,21.94 v62,21.9 | U$1.21 45.76,16.26 47.17,17.67 v47.17,21.89 | v54.55,21.85 54.55,19.95 v54.6,19.9
  Bottom 0.152: v62,21.9 54.6,21.9 v54.55,21.85 54.52,21.89 v47.17,21.89 | v54.6,19.9 54.6,17.82 J4.A2
MOSI  (via drill 0.35)
  Top 0.152: U$1.19 46.58,15.26 v47.06,15.76 | U3.11P 60.04,21.24 v60,21.2 | v57.1,21.34 v57.1,19.9
  Bottom 0.152: 59.8,21.4 v60,21.2 59.86,21.34 v57.1,21.34 | v47.06,15.76 56.13,15.76 56.74,15.74 57.1,16.1 J4.A3 v57.1,19.9
N$1
  Top 0.152: U$1.1 38.49,10.09 Y1.P$1 37.45,7.5 C2.1
N$2
  Top 0.152: U$1.2 38.99,10.01 Y1.P$2 39.95,7.5 C1.1
N$3  (via drill 0.35)
  Top 0.152: R7.2 24.99,3.69 v25,3.7 | v30.2,3.7 IC2.7
  Bottom 0.152: v25,3.7 v30.2,3.7
N$4
  Top 0.152: U$1.43 36.8,14.76 C4.1
N$5
  Top 0.2: J1.A5 7.95,16.25 R11.2
N$6
  Top 0.152: R2.1 11.92,8.38 13.2,7.1 13.2,5.77 D2.C
  Top 0.203: 12.65,4.7 D2.C
N$7  (via drill 0.35)
  Top 0.152: R2.2 8.56,7.36 v8.3,7.1 | v8.36,5.2 9.02,4.54 U2.1
  Bottom 0.152: v8.3,7.1 8.3,5.26 v8.36,5.2
N$8
  Top 0.152: R3.2 7.38,6.11 U2.5
N$9
  Top 0.2: J1.B5 7.65,13.25 R10.2
N$10
  Top 0.406: J1.MP4 J1.MP2 J1.MP1 | J1.MP3 J1.MP1 | R12.1 1.57,21.37 J1.MP1
N$12
  Top 0.152: R6.1 45.3,20.85 D3.A
N$13  (via drill 0.3)
  Bottom 0.406: U3.1P 50.04,6.87 J6.3
  other vias: 50.04,6.88
SCK  (via drill 0.35)
  Top 0.152: U3.12P 58.04,20.76 v58.1,20.7 | U$1.20 46.16,15.76 47.6,17.2 47.6,20.6 v47.9,20.9
  Bottom 0.152: J4.A4 59.63,20.47 59.4,20.7 v58.1,20.7 49.6,20.7 49.4,20.9 v47.9,20.9
SCL  (via drill 0.35)
  Top 0.152: v50,15.19 49.31,15.19 48.9,15.6 v48.9,20.2 | v40.7,20.2 40.49,19.99 U$1.32 | IC2.6 32.97,2.43 33.3,2.1 38.05,2.1 R8.1 39.35,1.6 54.5,1.6 55,2.1 55,9.8 v54.6,10.2 v54.6,15.2
  Bottom 0.152: v48.9,20.2 v40.7,20.2 | J2.3 66.73,13.67 65.2,15.2 v54.6,15.2 50.01,15.2 v50,15.19 | 54.8,12.56 J4.B2 54.6,12.26 v54.6,10.2
SDA  (via drill 0.35)
  Top 0.152: 37.38,1.2 R9.1 36.88,1.16 35.24,1.16 | v48.7,14.4 48.2,14.9 v48.2,19.5 | v41.5,19.5 40.99,18.99 U$1.31 | IC2.5 35.24,1.16 | 35.24,1.16 v35.3,1.1 | v57,14.46 57,10.3 v57.1,10.2 v57.1,1
  Bottom 0.152: v48.2,19.5 v41.5,19.5 | v57.1,1 35.4,1 v35.3,1.1 | J2.4 68.27,11.13 64.9,14.5 57.16,14.5 v57,14.46 48.76,14.46 v48.7,14.4 | v57.1,10.2 v57.09,10.21 J4.B3
SWCLK
  Top 0.152: U$1.45 36.76,13.76 35.6,12.6 35.6,9 34.88,8.28 J5.3
SWDIO
  Top 0.152: U$1.46 36.96,13.26 36.1,12.4 36.1,7.44 J5.2
USBD_N  (via drill 0.35)
  Top 0.152: v39.81,25.01 39.99,24.82 U$1.33 | J1.A7 5.35,14.75 v4.9,15.2 5.45,15.75 J1.B7
  Bottom 0.152: v39.81,25.01 39.71,25.11 27.73,25.11 26.73,26.11 14.97,26.11 10.08,21.21 10.04,21.21 9.86,21.04 | 9.86,21.04 | v4.9,15.2 7.09,15.2 7.59,15.7 7.59,18.77 9.46,20.64 9.53,20.64 9.86,20.97 9.86,21.02 9.86,21.04
USBD_P  (via drill 0.35)
  Top 0.152: v39.2,24.4 39.49,24.11 U$1.34 | J1.B6 7.05,14.25 v7.5,14.7 6.95,15.25 J1.A6
  Bottom 0.152: v39.2,24.4 38.8,24.8 27.6,24.8 26.6,25.8 15.1,25.8 10.16,20.86 | 10.16,20.91 10.16,20.86 | v7.5,14.7 7.9,15.1 7.9,18.65 9.59,20.34 9.66,20.34 10.11,20.79 10.16,20.84 10.16,20.86
VBAT  (via drill 0.35)
  Top 0.406: R4.2 10.96,1.44 C9.2 10.92,1.65 U2.3 10.92,4.11 v10.52,4.52 | 6.75,28.3 D1.A 5.35,28.15 v5.32,28.12
  Bottom 0.406: v10.52,4.52 5.78,4.52 4.92,5.38 X3.2 | 5.2,7.93 X3.2 | v5.32,28.12 5.32,25.12 1,20.8 1,10.1 2.89,8.21 X3.2
VBUS
  Top 0.254: J1.A4 J1.B9 | 6.23,12.6 J1.B4 J1.A9
  Top 0.305: J1.A4 6.23,17.4
  Top 0.406: D2.A 11.27,6.46 U2.4 10.68,6.35 10.68,6.38 9.6,7.47 9.6,12.6 | 6.23,12.6 9.6,12.6 | D1.C 8.43,24.45 | 8.43,24.45 R1.1 8.55,24.57 U1.1 | 8.43,24.45 8.43,22.67 C5.2 8.49,20.11 9.6,19 9.6,17.4 | 9.6,12.6 9.6,17.4 | 6.23,17.4 9.6,17.4

### Text on the board
tNames: GND | +3V3 | SCL | SDA
bNames: +3V3 | MISO | MOSI | SCK | GND | GND | +3V3 | SCL | SDA | D0 | GND | SWCLK | SWDIO | +3V3